# Altium schematic sheet GAPandPeripherals.SchDoc: PULP - shield - GAP
size A3; Revision: 1.1; SheetNumber: 1; SheetTotal: 2
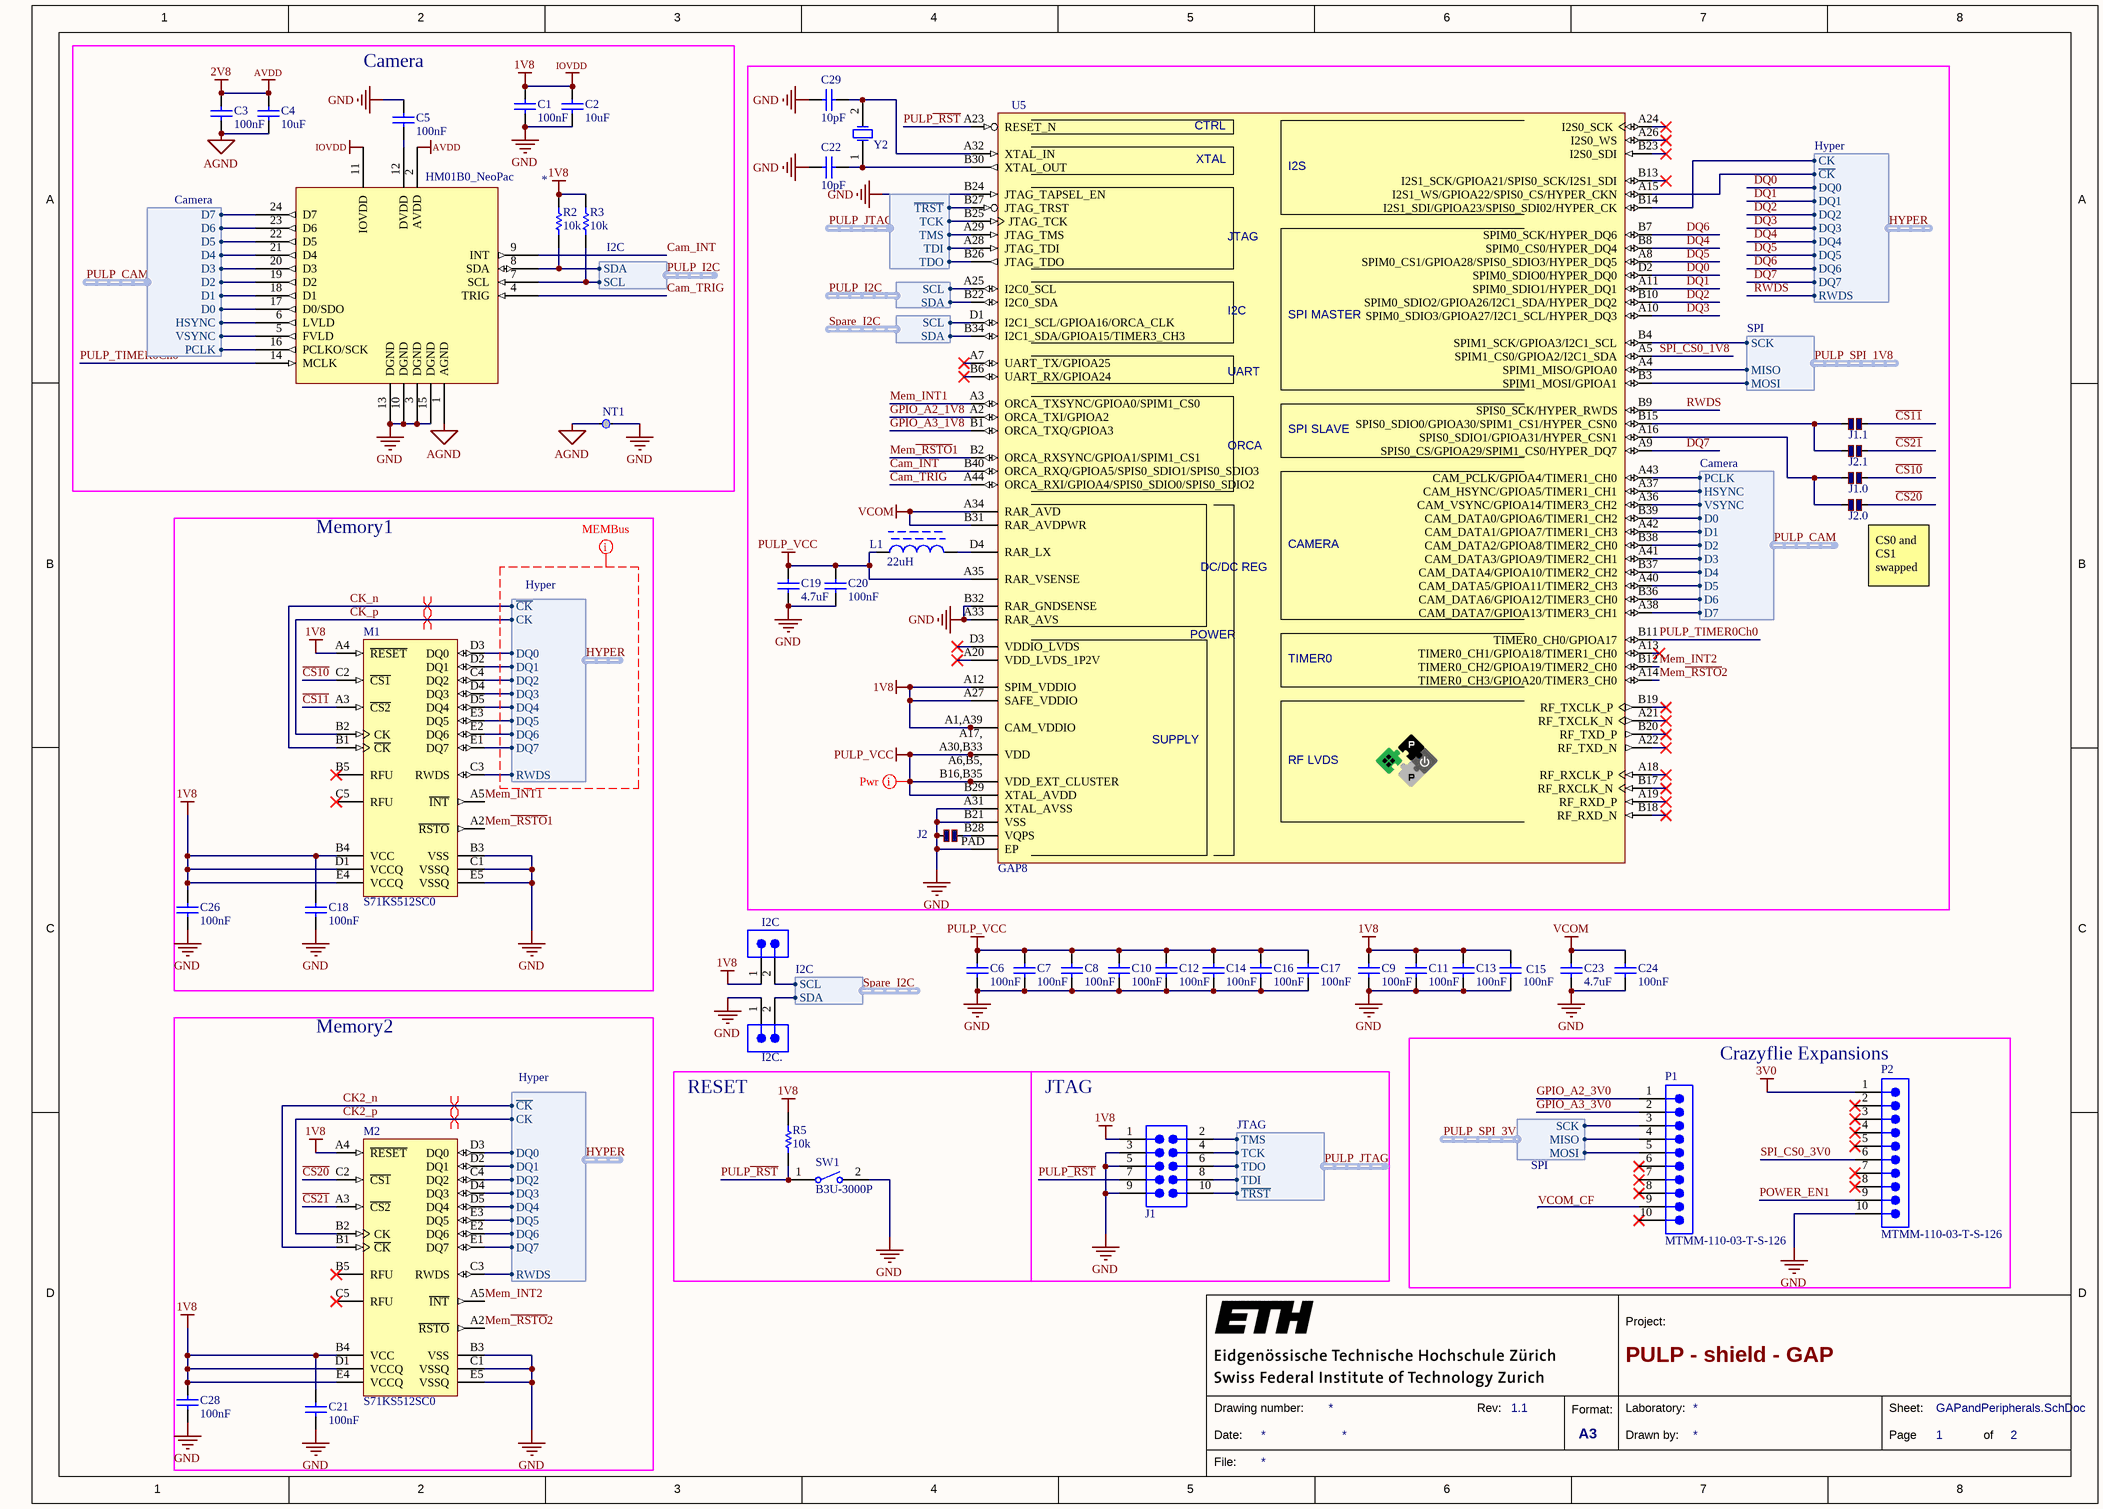
[diagram p0: GAPandPeripherals.SchDoc]

## Parts
*  HM01B0_NeoPac  [Connector_5037722410]
C1  100nF  [CAPC0402(1005)60_N]
C2  10uF  [CAPC0402(1005)60_N]
C3  100nF  [CAPC0402(1005)60_N]
C4  10uF  [CAPC0402(1005)60_N]
C5  100nF  [CAPC0402(1005)60_N]
C6  100nF  [CAPC0402(1005)60_N]
C7  100nF  [CAPC0402(1005)60_N]
C8  100nF  [CAPC0402(1005)60_N]
C9  100nF  [CAPC0402(1005)60_N]
C10  100nF  [CAPC0402(1005)60_N]
C11  100nF  [CAPC0402(1005)60_N]
C12  100nF  [CAPC0402(1005)60_N]
C13  100nF  [CAPC0402(1005)60_N]
C14  100nF  [CAPC0402(1005)60_N]
C15  100nF  [CAPC0402(1005)60_N]
C16  100nF  [CAPC0402(1005)60_N]
C17  100nF  [CAPC0402(1005)60_N]
C18  100nF  [CAPC0402(1005)60_N]
C19  4.7uF  [CAPC0402(1005)60_N]
C20  100nF  [CAPC0402(1005)60_N]
C21  100nF  [CAPC0402(1005)60_N]
C22  10pF  [CAPC0402(1005)60_L]
C23  4.7uF  [CAPC0402(1005)60_N]
C24  100nF  [CAPC0402(1005)60_N]
C26  100nF  [CAPC0402(1005)60_N]
C28  100nF  [CAPC0402(1005)60_N]
C29  10pF  [CAPC0402(1005)60_L]
I2C  GRPB012VWVN-RC  [Pin Header, 1x2, TH]  (value not drawn)
I2C.  GRPB012VWVN-RC  [Pin Header, 1x2, TH]  (value not drawn)
J1  20021111-00010T4LF  [20021111-00010T4LF]  (value not drawn)
J1.0  Solder Jumper  [Small Solder Jumper]  (value not drawn)
J1.1  Solder Jumper  [Small Solder Jumper]  (value not drawn)
J2  Solder Jumper  [Small Solder Jumper]  (value not drawn)
J2.0  Solder Jumper  [Small Solder Jumper]  (value not drawn)
J2.1  Solder Jumper  [Small Solder Jumper]  (value not drawn)
L1  value 22uH  [SRN4026]  (hidden comment: SRN4026-220M)
M1  S71KS512SC0  [FBGA24_A-130]
M2  S71KS512SC0  [FBGA24_A-130]
NT1  Net Tie  [Net Tie]  (value not drawn)  (net tie, no BOM)
P1  MTMM-110-03-T-S-126  [SMTC-MTMM-110-03-X-S-126]
P2  MTMM-110-03-T-S-126  [SMTC-MTMM-110-03-X-S-126]
R2  10k  [RESC1005X40X25NL05T05]
R3  10k  [RESC1005X40X25NL05T05]
R5  10k  [RESC1005X40X25NL05T05]
SW1  B3U-3000P  [OMRON-B3U-3000P_V]
U5  GAP8  [RKC0088A_V]
Y2  ABS07-32.768KHZ-7-T  [ABRA-ABS07-2_V]  (value not drawn)

## Blocks framed on the sheet
Camera: * C1-C5 NT1 R2 R3
Memory1: C18 C26 M1
Memory2: C21 C28 M2
Crazyflie Expansions: P1 P2
RESET: R5 SW1
JTAG: J1

## Harnesses
Hyper: CK, ~{CK}, DQ0, DQ1, DQ2, DQ3, DQ4, DQ5, DQ6, DQ7, RWDS
JTAG: ~{TRST}, TMS, TDO, TDI, TCK
SPI: SCK, MISO, MOSI
Camera: PCLK, HSYNC, D0, D1, D2, D3, D4, D5, D6, D7, VSYNC
I2C: SDA, SCL

## Nets
1V8: *.11(IOVDD) C1.2 C2.2 C9.2 C11.2 C13.2 C15.2 C18.2 C21.2 C26.2 C28.2 I2C.1 J1.1 M1.A4(~{RESET}) M1.B4(VCC) M1.D1(VCCQ) M1.E4(VCCQ) M2.A4(~{RESET}) M2.B4(VCC) M2.D1(VCCQ) M2.E4(VCCQ) R2.2 R3.2 R5.2 U5.A1(CAM_VDDIO) U5.A12(SPIM_VDDIO) U5.A27(SAFE_VDDIO) U5.A39(CAM_VDDIO)  [also labelled IOVDD]
2V8: *.2(AVDD) C3.2 C4.2  [also labelled AVDD]
3V0: P2.1
AGND: *.1(AGND) C3.1 C4.1 NT1.1(NT)
GND: *.3(DGND) *.10(DGND) *.13(DGND) *.15(DGND) C1.1 C2.1 C5.2 C6.1 C7.1 C8.1 C9.1 C10.1 C11.1 C12.1 C13.1 C14.1 C15.1 C16.1 C17.1 C18.1 C19.1 C20.1 C21.1 C22.1 C23.1 C24.1 C26.1 C28.1 C29.1 I2C..1 J1.3 J1.5 J1.9 J2.2 M1.B3(VSS) M1.C1(VSSQ) M1.E5(VSSQ) M2.B3(VSS) M2.C1(VSSQ) M2.E5(VSSQ) NT1.2(NT) P2.10 SW1.2 U5.A31(XTAL_AVSS) U5.A33(RAR_AVS) U5.B21(VSS) U5.B24(JTAG_TAPSEL_EN) U5.B32(RAR_GNDSENSE) U5.PAD(EP)
PULP_VCC: C6.2 C7.2 C8.2 C10.2 C12.2 C14.2 C16.2 C17.2 C19.2 C20.2 L1.1 U5.A6(VDD_EXT_CLUSTER) U5.A17(VDD) U5.A30(VDD) U5.A35(RAR_VSENSE) U5.B5(VDD_EXT_CLUSTER) U5.B16(VDD_EXT_CLUSTER) U5.B29(XTAL_AVDD) U5.B33(VDD) U5.B35(VDD_EXT_CLUSTER)
VCOM: C23.2 C24.2 U5.A34(RAR_AVD) U5.B31(RAR_AVDPWR)
~{CS10}: J1.0.2 M1.C2(~{CS1})
~{CS11}: J1.1.2 M1.A3(~{CS2})
~{CS20}: J2.0.2 M2.C2(~{CS1})
~{CS21}: J2.1.2 M2.A3(~{CS2})
Cam_INT: *.9(INT) U5.B40(ORCA_RXQ/GPIOA5/SPIS0_SDIO1/SPIS0_SDIO3)
Cam_TRIG: *.4(TRIG) U5.A44(ORCA_RXI/GPIOA4/SPIS0_SDIO0/SPIS0_SDIO2)
CK2_n: M1.B1(~{CK}) M2.B1(~{CK}) U5.A15(I2S1_WS/GPIOA22/SPIS0_CS/HYPER_CKN) ; harness Hyper.~{CK}  [also labelled CK_n]
CK2_p: M1.B2(CK) M2.B2(CK) U5.B14(I2S1_SDI/GPIOA23/SPIS0_SDI02/HYPER_CK) ; harness Hyper.CK  [also labelled CK_p]
DQ0: M1.D3(DQ0) M2.D3(DQ0) U5.D2(SPIM0_SDIO0/HYPER_DQ0) ; harness Hyper.DQ0
DQ1: M1.D2(DQ1) M2.D2(DQ1) U5.A11(SPIM0_SDIO1/HYPER_DQ1) ; harness Hyper.DQ1
DQ2: M1.C4(DQ2) M2.C4(DQ2) U5.B10(SPIM0_SDIO2/GPIOA26/I2C1_SDA/HYPER_DQ2) ; harness Hyper.DQ2
DQ3: M1.D4(DQ3) M2.D4(DQ3) U5.A10(SPIM0_SDIO3/GPIOA27/I2C1_SCL/HYPER_DQ3) ; harness Hyper.DQ3
DQ4: M1.D5(DQ4) M2.D5(DQ4) U5.B8(SPIM0_CS0/HYPER_DQ4) ; harness Hyper.DQ4
DQ5: M1.E3(DQ5) M2.E3(DQ5) U5.A8(SPIM0_CS1/GPIOA28/SPIS0_SDIO3/HYPER_DQ5) ; harness Hyper.DQ5
DQ6: M1.E2(DQ6) M2.E2(DQ6) U5.B7(SPIM0_SCK/HYPER_DQ6) ; harness Hyper.DQ6
DQ7: M1.E1(DQ7) M2.E1(DQ7) U5.A9(SPIS0_CS/GPIOA29/SPIM1_CS0/HYPER_DQ7) ; harness Hyper.DQ7
GPIO_A2_1V8: U5.A2(ORCA_TXI/GPIOA2)
GPIO_A2_3V0: P1.1
GPIO_A3_1V8: U5.B1(ORCA_TXQ/GPIOA3)
GPIO_A3_3V0: P1.2
Mem~{_RSTO}1: M1.A2(~{RSTO}) U5.B2(ORCA_RXSYNC/GPIOA1/SPIM1_CS1)
Mem~{_RSTO}2: M2.A2(~{RSTO}) U5.A14(TIMER0_CH3/GPIOA20/TIMER3_CH0)
Mem_INT1: M1.A5(~{INT}) U5.A3(ORCA_TXSYNC/GPIOA0/SPIM1_CS0)
Mem_INT2: M2.A5(~{INT}) U5.B12(TIMER0_CH2/GPIOA19/TIMER2_CH0)
POWER_EN1: P2.9
PULP~{_RST}: J1.7 R5.1 SW1.1 U5.A23(RESET_N)
PULP_CAM.D0: *.17(D0/SDO) U5.B39(CAM_DATA0/GPIOA6/TIMER1_CH2) ; harness Camera.D0
PULP_CAM.D1: *.18(D1) U5.A42(CAM_DATA1/GPIOA7/TIMER1_CH3) ; harness Camera.D1
PULP_CAM.D2: *.19(D2) U5.B38(CAM_DATA2/GPIOA8/TIMER2_CH0) ; harness Camera.D2
PULP_CAM.D3: *.20(D3) U5.A41(CAM_DATA3/GPIOA9/TIMER2_CH1) ; harness Camera.D3
PULP_CAM.D4: *.21(D4) U5.B37(CAM_DATA4/GPIOA10/TIMER2_CH2) ; harness Camera.D4
PULP_CAM.D5: *.22(D5) U5.A40(CAM_DATA5/GPIOA11/TIMER2_CH3) ; harness Camera.D5
PULP_CAM.D6: *.23(D6) U5.B36(CAM_DATA6/GPIOA12/TIMER3_CH0) ; harness Camera.D6
PULP_CAM.D7: *.24(D7) U5.A38(CAM_DATA7/GPIOA13/TIMER3_CH1) ; harness Camera.D7
PULP_CAM.HSYNC: *.6(LVLD) U5.A37(CAM_HSYNC/GPIOA5/TIMER1_CH1) ; harness Camera.HSYNC
PULP_CAM.PCLK: *.16(PCLKO/SCK) U5.A43(CAM_PCLK/GPIOA4/TIMER1_CH0) ; harness Camera.PCLK
PULP_CAM.VSYNC: *.5(FVLD) U5.A36(CAM_VSYNC/GPIOA14/TIMER3_CH2) ; harness Camera.VSYNC
PULP_I2C.SCL: *.7(SCL) R3.1 U5.A25(I2C0_SCL) ; harness I2C.SCL
PULP_I2C.SDA: *.8(SDA) R2.1 U5.B22(I2C0_SDA) ; harness I2C.SDA
PULP_JTAG~{.TRST}: J1.10 U5.B27(JTAG_TRST) ; harness JTAG.~{TRST}
PULP_JTAG.TCK: J1.4 U5.B25(JTAG_TCK) ; harness JTAG.TCK
PULP_JTAG.TDI: J1.8 U5.A28(JTAG_TDI) ; harness JTAG.TDI
PULP_JTAG.TDO: J1.6 U5.B26(JTAG_TDO) ; harness JTAG.TDO
PULP_JTAG.TMS: J1.2 U5.A29(JTAG_TMS) ; harness JTAG.TMS
PULP_SPI_1V8.MISO: U5.A4(SPIM1_MISO/GPIOA0) ; harness SPI.MISO
PULP_SPI_1V8.MOSI: U5.B3(SPIM1_MOSI/GPIOA1) ; harness SPI.MOSI
PULP_SPI_1V8.SCK: U5.B4(SPIM1_SCK/GPIOA3/I2C1_SCL) ; harness SPI.SCK
PULP_SPI_3V0.MISO: P1.4 ; harness SPI.MISO
PULP_SPI_3V0.MOSI: P1.5 ; harness SPI.MOSI
PULP_SPI_3V0.SCK: P1.3 ; harness SPI.SCK
PULP_TIMER0Ch0: *.14(MCLK) U5.B11(TIMER0_CH0/GPIOA17)
RWDS: M1.C3(RWDS) M2.C3(RWDS) U5.B9(SPIS0_SCK/HYPER_RWDS) ; harness Hyper.RWDS  [project net HYPER.RWDS]
Spare_I2C.SCL: I2C.2 U5.D1(I2C1_SCL/GPIOA16/ORCA_CLK) ; harness I2C.SCL
Spare_I2C.SDA: I2C..2 U5.B34(I2C1_SDA/GPIOA15/TIMER3_CH3) ; harness I2C.SDA
SPI_CS0_1V8: U5.A5(SPIM1_CS0/GPIOA2/I2C1_SDA)
SPI_CS0_3V0: P2.6
VCOM_CF: P1.9
Net*_12: *.12(DVDD) C5.1
NetC22_2: C22.2 U5.B30(XTAL_OUT) Y2.1(X1)
NetC29_2: C29.2 U5.A32(XTAL_IN) Y2.2(X2)
NetJ1.0_1: J1.0.1 J2.0.1 U5.A16(SPIS0_SDIO1/GPIOA31/HYPER_CSN1)
NetJ1.1_1: J1.1.1 J2.1.1 U5.B15(SPIS0_SDIO0/GPIOA30/SPIM1_CS1/HYPER_CSN0)
NetJ2_1: J2.1 U5.B28(VQPS)
NetL1_2: L1.2 U5.D4(RAR_LX)

Not connected (* = marked no-connect by the designer): M1 B5(RFU)* C5(RFU)*; M2 B5(RFU)* C5(RFU)*; P1 6* 7* 8* 10*; P2 2* 3* 4* 5* 7* 8*; U5 A7(UART_TX/GPIOA25)* A13(TIMER0_CH1/GPIOA18/TIMER1_CH0)* A18(RF_RXCLK_P)* A19(RF_RXD_P)* A20(VDD_LVDS_1P2V)* A21(RF_TXCLK_N)* A22(RF_TXD_N)* A24(I2S0_SCK)* A26(I2S0_WS)* B6(UART_RX/GPIOA24)* B13(I2S1_SCK/GPIOA21/SPIS0_SCK/I2S1_SDI)* B17(RF_RXCLK_N)* B18(RF_RXD_N)* B19(RF_TXCLK_P)* B20(RF_TXD_P)* B23(I2S0_SDI)* D3(VDDIO_LVDS)*

## Layout directives
differential pair: CK2_n, CK2_p
net class Undefined: HYPER
net class POWER: PULP_VCC

## Notes on the sheet
- (near J2.0) CS0 and CS1 swapped
- 1
- 2
- 3
- 4
- 5
- 6
- 7
- 8
- A
- B
- C
- D
- Project:
- Date:
- Drawing number:
- Rev:
- Format:
- A3
- Drawn by:
- Laboratory:
- Page
- Sheet:
- of
- File:
- (in symbol CMP-01034-2) CTRL; XTAL; I2S; JTAG; I2C; SPI MASTER; UART; ORCA; SPI SLAVE; CAMERA; DC/DC REG; POWER; TIMER0; A1,A39; A17,; SUPPLY; A30,B33; A6,B5,; RF LVDS; B16,B35

## Library data of the parts
C1 C3 C5-C18 C20 C21 C24 C26 C28 = CMP-1034-02065-1: CAP 100nF 10V ±10% 0402 (1005 Metric) Thickness 0.6mm SMD; Case-EIA: 0402; Case-Metric: 1005; Tolerance: Â±10%; Max Thickness: 0.6 mm; Value: 100nF; Rated Voltage: 10 V; Technology: SMT
C2 C4 = CMP-1034-02138-1: CAP 10uF 6.3V ±20% 0402 (1005 Metric) Thickness 0.6mm SMD; Case-Metric: 1005; Case-EIA: 0402; Tolerance: Â±20%; Rated Voltage: 6.3 V; Technology: SMT; Max Thickness: 0.6 mm; Value: 10uF
C19 C23 = CMP-1034-02137-1: CAP 4.7uF 6.3V ±20% 0402 (1005 Metric) Thickness 0.6mm SMD; Case-Metric: 1005; Case-EIA: 0402; Tolerance: Â±20%; Technology: SMT; Max Thickness: 0.6 mm; Rated Voltage: 6.3 V; Value: 4.7uF
C22 C29 = CMP-1034-00722-1: CAP 10pF 50V ±2% 0402 (1005 Metric) Thickness 0.6mm SMD; Tolerance: Â±2%; Case-Metric: 1005; Case-EIA: 0402; Technology: SMT; Value: 10pF; Max Thickness: 0.6 mm; Rated Voltage: 50 V
I2C I2C. = CMP-00149-1: CONN HEADER 1.27mm Pitch 1x2 POS TH DL PCB AU; Manufacturer: Sullins Connector Solutions; Connector Type: Header, Unshrouded; Number of Positions: 2; Number of Positions Loaded: All; Packaging: Bulk; Contact Type: Male Pin; Pitch: -; Number of Rows: 2; Mounting Type: Through Hole; Termination: Solder; Fastening Type: -; Features: -; Contact Finish: Gold; Contact Finish Thickness: Flash; Color: -; Manufacturer Part Number: GRPB012VWVN-RC; Supplier: Digi-Key; Supplier Part Number: S9015E-01-ND; ComponentLink1Description: GRPB_%20_2VWVN-RC%2010954-C.pdf; ComponentLink1URL: http://media.digikey.com/pdf/Data%20Sheets/Sullins%20PDFs/GRPB_%20_2VWVN-RC%2010954-C.pdf
J1 = CMP-01117-1: CONN HEADER VERT 10POS 1.27MM; Number of Contacts: 10; Insulation Resistance: 100MR; Current Rating: 10A; Voltage Rating: 125V; Contact Resistance: 30mR; Gender: Male; Row Spacing: 0.05inch; Stack Height: 2.5mm; Connector Type: Male Pin,Header; Contact Post Length: 2.3mm; Orientation: Straight; Lead Free: Lead Free; Max Operating Temperature: 85°C; Housing Material: Plastic; Package Quantity: 93; Packaging: Rail/Tube; Radiation Hardening: No; Contact Mating Length: 0.12inch; Mount: Through Hole; Max Voltage Rating (AC): 125V; Housing Color: Black; Contact Plating: Gold; Pitch: 1.27mm; Color: Black; Length: 6.35mm; Number of Positions: 10; Min Operating Temperature: -40°C; REACH SVHC: No SVHC; Termination: Solder; Number of Rows: 2; Contact Material: Nickel,Copper,Copper Alloy,Gold; Depth: 3.4mm
J1.0 J1.1 J2 J2.0 J2.1 = CMP-00005-4: Value: 1; Technology: SMT
L1 = CMP-00905-1: Inductor Power Semi-Shielded Wirewound 22uH 20% 100KHz 11Q-Factor Ferrite 670mA 234mOhm DCR 1515 T/R; DC Resistance (DCR): 234mR; Self Resonant Frequency: 16MHz; Mount: Surface Mount; Case/Package: Nonstandard; Weight: 0.004938oz; Core Material: Ferrite; Min Operating Temperature: -40°C; Max Operating Temperature: 125°C; Packaging: Tape and Reel; Tolerance: 20%; Composition: Wirewound; Inductance: 22uh; Current Rating: 670mA; Saturation Current: 670mA; Shielding: Shielded; Test Frequency: 100kHz; Max DC Current: 670mA; Termination: SMD/SMT; RMS Current (Irms): 670mA; Inductance Tolerance: 20%; Package Quantity: 3000; Length: 4mm; Height: 2.5mm; Width: 4mm; Height - Seated (Max): 0.098inch; Depth: 4mm; REACH SVHC: No SVHC
M1 M2 = CMP-00514-2: IC 512MB FLASH 64MB DRAM 24FBGA; Manufacturer: Cypress Semiconductor Corp; Memory Format: FLASH, RAM; Memory Type: Non-Volatile; Memory Size: 512Mbit Flash, 64Mbit RAM; Speed: 100MHz; Interface: Parallel, Serial; Voltage - Supply: 1.8V; Series: HyperFlash™ + HyperRAM™ KS; Package / Case: 24-VBGA; Supplier Device Package: 24-FBGA(6x8)
NT1 = CMP-00050-2: Net Tie - 0.15mm width, 0.5mm length
P1 P2 = CMP-1029-00120-1: Modified Through-Hole Header, Vertical, -55 to 105 degC, 2 mm Pitch, 10-Pin, Male, RoHS; Manufacturer: Samtec; Pitch: 2 mm; DatasheetVersion: F-214; ComponentLink1URL: http://www.samtec.com; ComponentLink2Description: Datasheet; Orientation: Vertical; ComponentLink3Description: Package Specification; PackageReference: MTMM-110-03-X-S-126; PackageVersion: AE, 12/1993; Temperature Range: -55 to 105 degC; PackageDescription: 2mm Terminal Strip Assembly; RoHS: True; ComponentLink3URL: http://www.samtec.com/documents/webfiles/cpdf/MTMM-1XX-XX-XX-X-XXX-XX-XXX-MKT.pdf; PartNumber: MTMM-110-03-T-S-126; ComponentLink2URL: http://d2a072wq521u33.cloudfront.net/catalog_english//MTMM_TH.PDF; ComponentLink1Description: Manufacturer URL; Mounting Technology: Through-hole
R2 R3 R5 = CMP-2002-00607-3: Chip Resistor, 10 KOhm, +/- 1%, 100 mW, -55 to 155 degC, 0402 (1005 Metric), RoHS, Tape and Reel; Manufacturer: Basic Passives; PartNumber: ERJ-2RKF1002X; Case\/Package: 0402; Resistance: 10 KOhm; Voltage Rating: 50 V; Power Rating: 100 mW; Packaging: Tape and Reel; Width: 0.5 mm; Package Quantity: 10000; Radiation Hardening: No; Min Operating Temperature: -55 degC; Case Code (Imperial): 0402; REACH SVHC: Yes; PackageDescription: 2-Pin Surface Mount Device, Body 1 x 0.5 mm; Length: 1 mm; ComponentLink1Description: Manufacturer URL; PackageReference: 0402; RoHSCompliant: true; ComponentLink1URL: http://www.panasonic.com/; Height: 0.35 mm; ComponentLink2Description: Datasheet; DatasheetVersion: 04/2015; Mounting Technology: Surface Mount; ComponentLink2URL: http://industrial.panasonic.com/cdbs/www-data/pdf/RDA0000/AOA0000C86.pdf; Max Operating Temperature: 155 degC; Pins: 2; Tolerance: 1%; Case Code (Metric): 1005; Mount: Surface Mount
SW1 = CMP-1677-00003-1: Ultra-Small Tactile Switch, 1 to 50 mA, 3 to 12 V, -25 to 70 degC, 2-Pin SMD, RoHS, Tape and Reel; Tolerance: 20%; Voltage Rating (DC): 50 V; Capacitance: 470 uF; Case\Package: Radial; PackageReference: B3U-3000P; Min Operating Temperature: -40 degC; Length: 20 mm; Mount: Through Hole; ComponentLink2Description: Datasheet; RoHSCompliant: true; ComponentLink1URL: http://www.omron.com/; Package Quantity: 200; Radiation Hardening: No; Height: 20 mm; ComponentLink2URL: https://www.omron.com/ecb/products/pdf/en-b3u.pdf; Diameter: 10 mm; Max Operating Temperature: 85 degC; Lead Pitch: 5 mm; DatasheetVersion: Jan-15; Packaging: Bulk; PackageDescription: 2-Pin Surface Mount Device, Body 4 x 3.2 mm; Voltage Rating: 50 V; Pins: 2; ComponentLink1Description: Manufacturer URL; REACH SVHC: No SVHC
U5 = CMP-01034-2: Package: QFN88
Y2 = CMP-00422-1: 32.768kHz ±20ppm Crystal 7pF 70 kOhm -40°C ~ 85°C  Surface Mount 2-SMD, No Lead; Brand: ABRACON; Case Height: 0.9 mm; Case Length: 3.2 mm; Case Width: 1.5 mm; ESR: 70 kOhms; Dimensions: 1.5 mm W x 3.2 mm L x 0.9 mm H; Manufacturer: ABRACON; Frequency: 32.768 kHz; Frequency Stability: 20 PPM; Load Capacitance: 7 pF; Package / Case: 3.2 mm x 1.5 mm; Operating Temperature Range: - 40 C to + 85 C; Mounting Style: SMD/SMT; Factory Pack Quantity: 3000; Product Category: Crystals; RoHS: Details; Tolerance: 20 PPM; Termination Style: SMD/SMT; Packaging: Reel; Series: ABS07; Type: Low Profile Crystal; Manufacturer Part Number: ABS07-32.768KHZ-7-T; Supplier: Digikey; Supplier Part Number: 535-9543-2-ND; ComponentLink1Description: abs07-3174144.pdf; ComponentLink1URL: https://datasheet.ciiva.com/3174/abs07-3174144.pdf; ComponentLink2Description: abs07-16199467.pdf; ComponentLink2URL: https://datasheet.ciiva.com/16199/abs07-16199467.pdf; ComponentLink3Description: abs07-8344589.pdf; ComponentLink3URL: https://datasheet.ciiva.com/8344/abs07-8344589.pdf; ComponentLink4Description: abs07-855947.pdf; ComponentLink4URL: https://datasheet.ciiva.com/855/abs07-855947.pdf; ComponentLink5Description: abs07-855945.pdf; ComponentLink5URL: https://datasheet.ciiva.com/855/abs07-855945.pdf; ComponentLink6Description: abs07-855946.pdf; ComponentLink6URL: https://datasheet.ciiva.com/855/abs07-855946.pdf